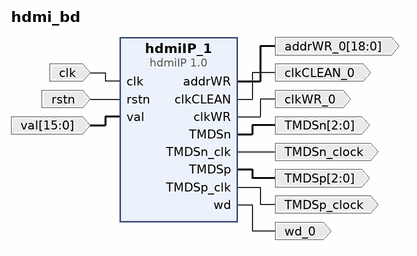
[diagram p0: block diagram of the top level]
# Vivado block design hdmi_bd, xc7z010clg400-1, Vivado 2019.2
create_bd_design hdmi_bd

create_bd_port -dir I -type clk clk
set_property -dict {CONFIG.FREQ_HZ 125000000} [get_bd_ports clk]
create_bd_port -dir I -type rst rstn
set_property -dict {CONFIG.POLARITY ACTIVE_LOW} [get_bd_ports rstn]
create_bd_port -dir O -from 2 -to 0 TMDSp
create_bd_port -dir O -from 2 -to 0 TMDSn
create_bd_port -dir O -type clk TMDSp_clock
create_bd_port -dir O -type clk TMDSn_clock
create_bd_port -dir I -from 15 -to 0 val
create_bd_port -dir O -from 18 -to 0 addrWR_0
create_bd_port -dir O clkCLEAN_0
create_bd_port -dir O clkWR_0
create_bd_port -dir O wd_0

create_bd_cell -type ip -vlnv user.org:user:hdmiIP:1.0 hdmiIP_1

# ---- connections ----

# net row_WR has one end: 
# net addrWR_1 has one end: 
# net wd_1 has one end: 
# net valMul_o_1 has one end: 
# net valIndex_o_1 has one end: 
# net valSub_o_1 has one end: 
connect_bd_net [get_bd_pins hdmiIP_1/TMDSp] [get_bd_ports TMDSp]
connect_bd_net [get_bd_pins hdmiIP_1/TMDSn] [get_bd_ports TMDSn]
connect_bd_net [get_bd_pins hdmiIP_1/TMDSp_clk] [get_bd_ports TMDSp_clock]
connect_bd_net [get_bd_pins hdmiIP_1/TMDSn_clk] [get_bd_ports TMDSn_clock]
connect_bd_net [get_bd_ports clk] [get_bd_pins hdmiIP_1/clk]
connect_bd_net -net reset_1 [get_bd_ports rstn] [get_bd_pins hdmiIP_1/rstn]
connect_bd_net -net val_0_1 [get_bd_ports val] [get_bd_pins hdmiIP_1/val]
connect_bd_net [get_bd_pins hdmiIP_1/addrWR] [get_bd_ports addrWR_0]
connect_bd_net [get_bd_pins hdmiIP_1/clkCLEAN] [get_bd_ports clkCLEAN_0]
connect_bd_net [get_bd_pins hdmiIP_1/clkWR] [get_bd_ports clkWR_0]
connect_bd_net [get_bd_pins hdmiIP_1/wd] [get_bd_ports wd_0]
set_property HDL_ATTRIBUTE.DEBUG true [get_bd_nets row_WR]
set_property HDL_ATTRIBUTE.MARK_DEBUG true [get_bd_nets row_WR]
set_property HDL_ATTRIBUTE.DEBUG true [get_bd_nets addrWR_1]
set_property HDL_ATTRIBUTE.MARK_DEBUG true [get_bd_nets addrWR_1]
set_property HDL_ATTRIBUTE.DEBUG true [get_bd_nets wd_1]
set_property HDL_ATTRIBUTE.MARK_DEBUG true [get_bd_nets wd_1]
set_property HDL_ATTRIBUTE.DEBUG true [get_bd_nets valMul_o_1]
set_property HDL_ATTRIBUTE.MARK_DEBUG true [get_bd_nets valMul_o_1]
set_property HDL_ATTRIBUTE.DEBUG true [get_bd_nets valIndex_o_1]
set_property HDL_ATTRIBUTE.MARK_DEBUG true [get_bd_nets valIndex_o_1]
set_property HDL_ATTRIBUTE.DEBUG true [get_bd_nets valSub_o_1]
set_property HDL_ATTRIBUTE.MARK_DEBUG true [get_bd_nets valSub_o_1]

validate_bd_design
save_bd_design
